# EAGLE design Tiny84_board (EAGLE 6.4)
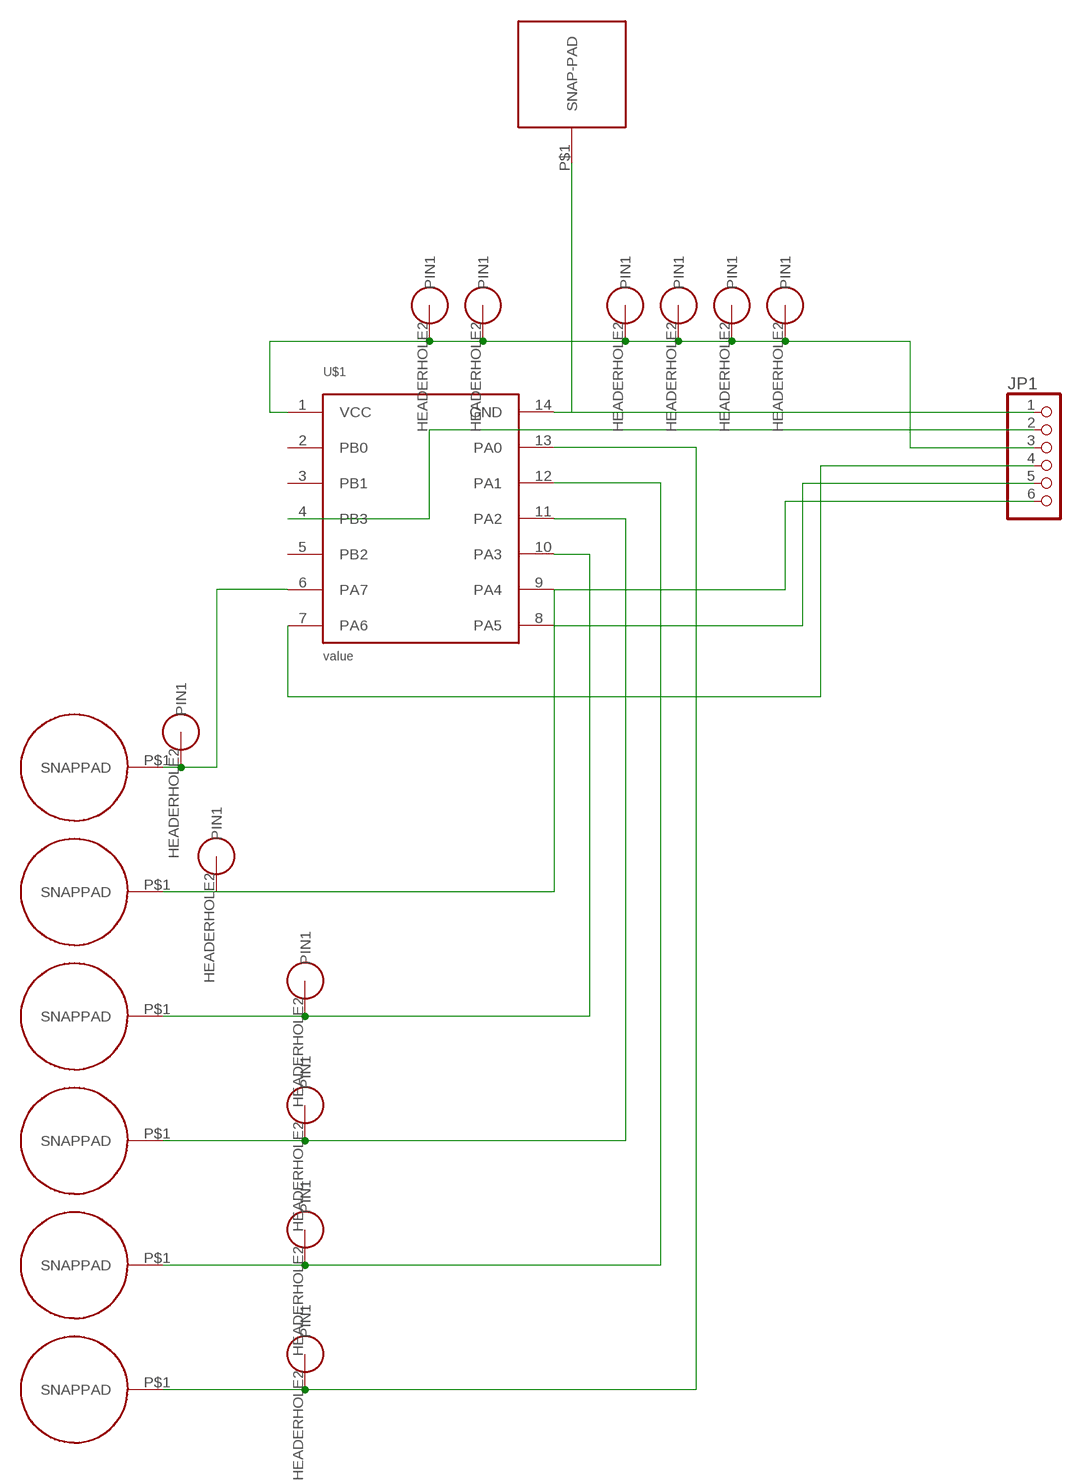
[diagram p0: schematic, sheet 1]

## Parts
JP1  PINHD-1X6/90  [1X06/90]
U$1  ATTINY84  [SOIC14]
U$2  SNAP-PAD_7MM_ROUND  [SNAP-PAD_7MM_RD]
U$3  SNAP-PAD_7MM_ROUND  [SNAP-PAD_7MM_RD]
U$4  SNAP-PAD_7MM_ROUND  [SNAP-PAD_7MM_RD]
U$5  SNAP-PAD_7MM_ROUND  [SNAP-PAD_7MM_RD]
U$6  SNAP-PAD_7MM_ROUND  [SNAP-PAD_7MM_RD]
U$7  SNAP-PAD_7MM_ROUND  [SNAP-PAD_7MM_RD]
U$14  SNAP-PAD_7MM_SQUARE  [SNAP-PAD_7MM_SQ]
U$15  HEADER_1PIN  [HEADER_1PIN]
U$16  HEADER_1PIN  [HEADER_1PIN]
U$17  HEADER_1PIN  [HEADER_1PIN]
U$19  HEADER_1PIN  [HEADER_1PIN]
U$20  HEADER_1PIN  [HEADER_1PIN]
U$21  HEADER_1PIN  [HEADER_1PIN]
U$24  HEADER_1PIN  [HEADER_1PIN]
U$25  HEADER_1PIN  [HEADER_1PIN]
U$26  HEADER_1PIN  [HEADER_1PIN]
U$27  HEADER_1PIN  [HEADER_1PIN]
U$30  HEADER_1PIN  [HEADER_1PIN]
U$31  HEADER_1PIN  [HEADER_1PIN]

## Nets
N$2: JP1.1 U$1.14(GND) U$14.P$1(SNAP-PAD)
N$3: U$1.6(PA7) U$2.P$1(SNAPPAD) U$27.HEADERHOLE2(PIN1)
N$4: JP1.4 U$1.7(PA6)
N$5: JP1.5 U$1.8(PA5)
N$6: JP1.6 U$1.9(PA4) U$3.P$1(SNAPPAD) U$26.HEADERHOLE2(PIN1)
N$8: U$1.13(PA0) U$7.P$1(SNAPPAD) U$21.HEADERHOLE2(PIN1)
N$14: JP1.2 U$1.4(PB3)
N$23: U$1.12(PA1) U$6.P$1(SNAPPAD) U$20.HEADERHOLE2(PIN1)
N$24: U$1.10(PA3) U$4.P$1(SNAPPAD) U$17.HEADERHOLE2(PIN1)
N$25: U$1.11(PA2) U$5.P$1(SNAPPAD) U$19.HEADERHOLE2(PIN1)
VCC: JP1.3 U$1.1(VCC) U$15.HEADERHOLE2(PIN1) U$16.HEADERHOLE2(PIN1) U$24.HEADERHOLE2(PIN1) U$25.HEADERHOLE2(PIN1) U$30.HEADERHOLE2(PIN1) U$31.HEADERHOLE2(PIN1)
Unconnected: U$1.2(PB0) U$1.3(PB1) U$1.5(PB2)

## Library data of the parts
JP1 = pinhead:PINHD-1X6: PIN HEADER
U$1 = hannahsEagleLib:ATTINY84
U$2-U$7 = hannahsEagleLib:SNAP-PAD_7MM_ROUND
U$14 = hannahsEagleLib:SNAP-PAD_7MM_SQUARE
U$15-U$17 U$19-U$21 U$24-U$27 U$30 U$31 = hannahsEagleLib:HEADER_1PIN

## Board
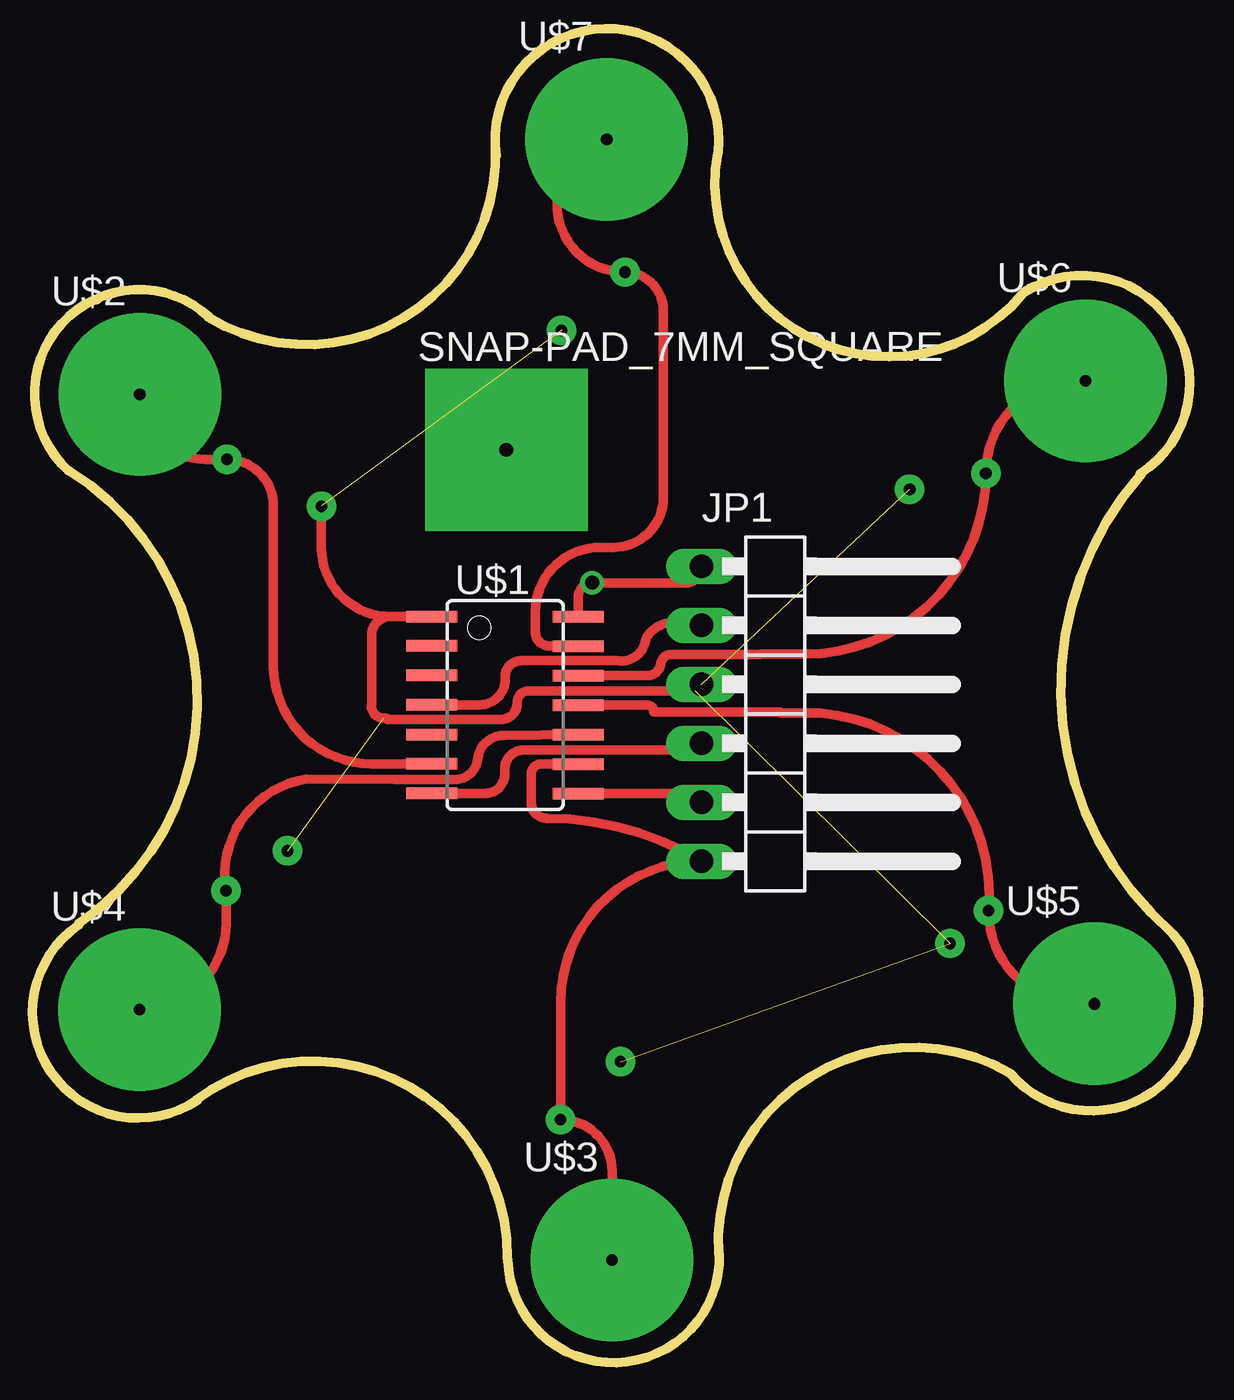
[diagram p1: board, top side]
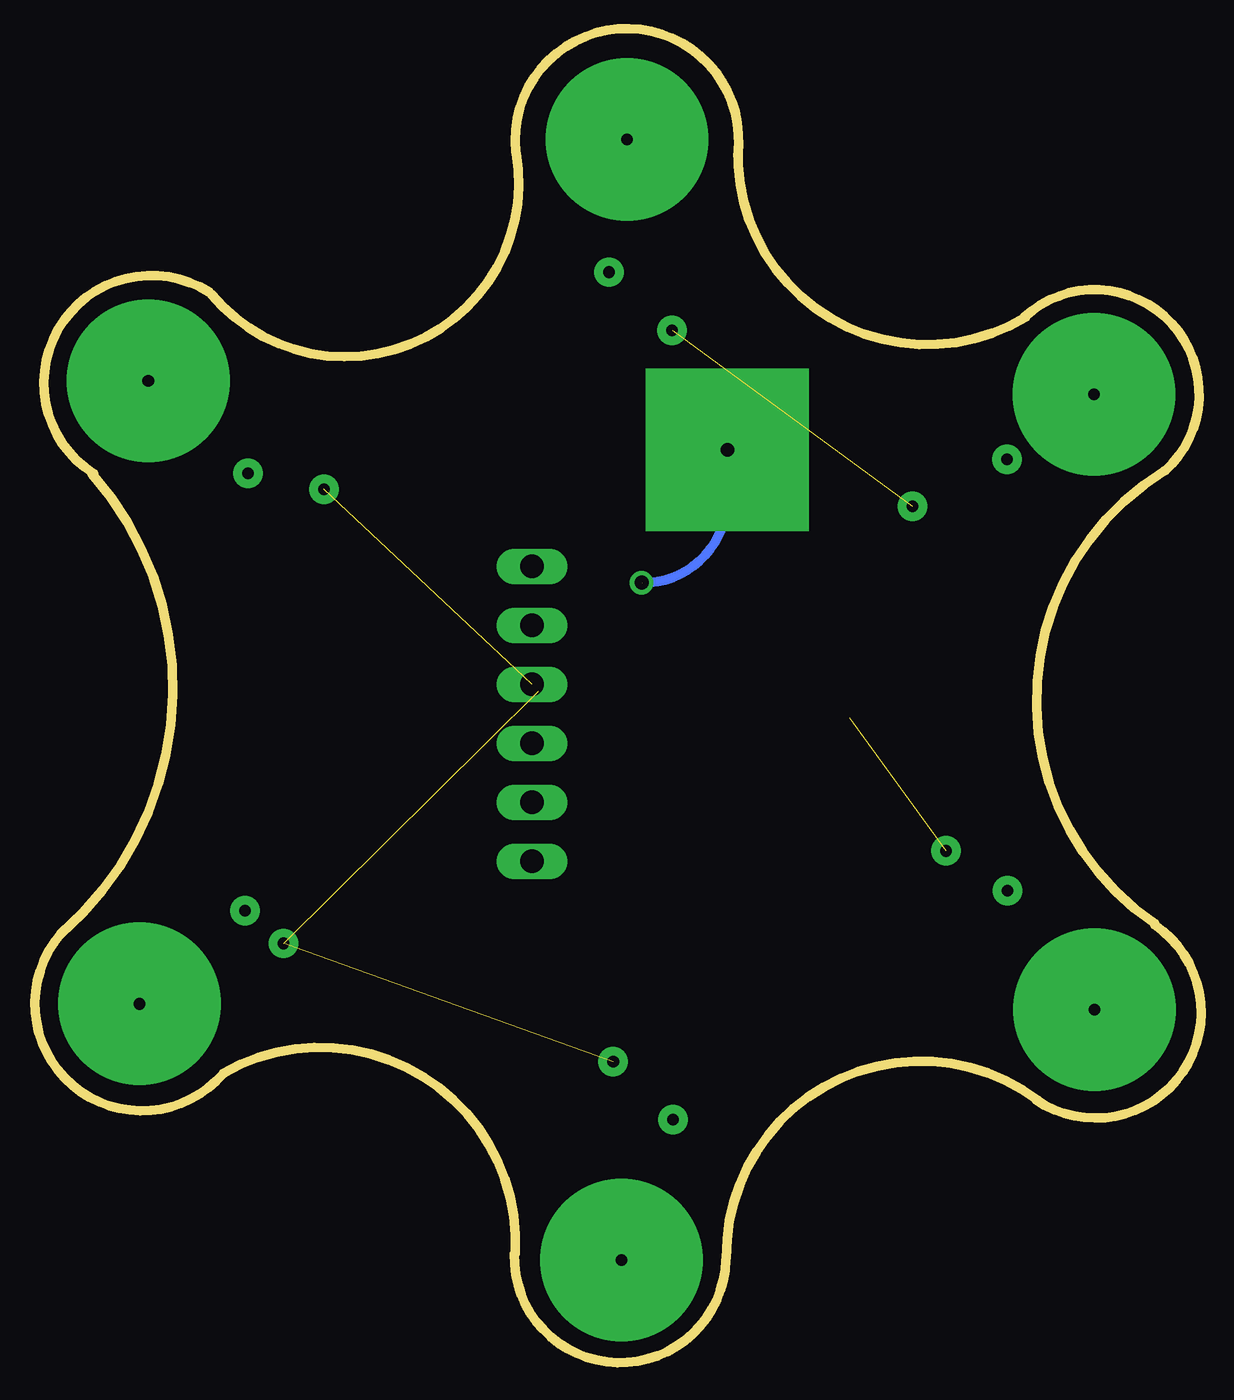
[diagram p2: board, bottom side, seen from below]

No outline drawn. Coordinates in mm, seen from the top.
Copper layers (1*16): Top 0.035mm / dielectric 1.5mm / Bottom 0.035mm
Design rules "default": minimum track width 10mil, minimum drill 24mil, track to track 8mil, track to pad 8mil, pad to pad 8mil, via to via 8mil, smd to smd 8mil, copper to edge 40mil, drill to drill 8mil, minimum pad ring 10mil, minimum via ring 8mil, stop-mask expansion 4mil, vias tented up to drill 0mil, thermal gap 10mil
Milling: 12 lines

### Footprints (pad centres in the part's own frame; a part is rotated, then mirrored left to right if it is on the bottom)
1X06/90 = drill 1.016 long: 1 -6.35,-3.81; 2 -3.81,-3.81; 3 -1.27,-3.81; 4 1.27,-3.81; 5 3.81,-3.81; 6 6.35,-3.81
SOIC14 = smd 0.5 x 2.2: 1 -1.905,-3.154; 2 -0.645,-3.154; 3 0.625,-3.154; 4 1.895,-3.154; 5 3.175,-3.154; 6 4.435,-3.154; 7 5.705,-3.154; 8 5.715,3.154; 9 4.445,3.154; 10 3.175,3.154; 11 1.905,3.154; 12 0.635,3.154; 13 -0.635,3.154; 14 -1.905,3.154
SNAP-PAD_7MM_RD = drill 0.5 pad 7: P$1 0,0
SNAP-PAD_7MM_SQ = drill 0.5 pad 7 square: P$1 0,0
HEADER_1PIN = drill 0.5 pad 1.27: HEADERHOLE2 0,0

### Placement (x,y rotation side)
JP1  67.83,40.47 270 top
U$1  55.56,42.75 270 top
U$2  39.83,54.23 0 top
U$3  60.17,16.93 0 top
U$4  39.81,27.73 0 top
U$5  80.93,27.97 0 top
U$6  80.55,54.81 0 top
U$7  59.93,65.21 0 top
U$14  55.62,51.84 0 top
U$15  47.65,49.41 0 top
U$16  46.19,34.56 0 top
U$17  43.54,32.85 0 top
U$19  76.38,31.98 0 top
U$20  76.26,50.82 0 top
U$21  60.72,59.49 0 top
U$24  60.53,25.48 0 top
U$25  74.72,30.58 0 top
U$26  57.95,22.98 0 top
U$27  43.58,51.42 0 top
U$30  72.98,50.14 0 top
U$31  57.99,56.99 0 top

### Tracks (layer width: path | path; a pad name or v marks a point on that pad's centre or on a via)
N$2  (1 unrouted)
  Top 0.4: U$1.14 58.71,45.53 arc-90 59.28,46.1 63.3,46.1 arc90 JP1.1
  Bottom 0.4: U$14.P$1 55.62,49.77 arc90 59.28,46.1
N$3
  Top 0.4: U$1.6 49.81,38.31 arc-90 45.59,42.53 45.59,49.42 arc90 U$27.HEADERHOLE2 42.64,51.42 arc-90 U$2.P$1
N$4
  Top 0.4: U$1.7 arc90 52.42,37.02 52.49,37.02 arc-90 52.52,37.04 54.72,37.04 arc90 55.55,37.87 55.55,38.07 arc-90 56.33,38.9 60.84,38.9 arc90 60.86,38.9 63.7,38.9 arc90 JP1.4
N$5
  Top 0.4: U$1.8 63.64,37.03 arc-90 JP1.5
N$6
  Top 0.4: U$1.9 57.11,38.3 arc90 56.69,37.87 56.69,36.62 arc90 57.35,35.97 arc-31 JP1.6 arc90 57.95,28.05 U$26.HEADERHOLE2 arc-90 60.17,20.76 U$3.P$1
N$8
  Top 0.4: U$1.13 57.47,43.38 arc-90 56.86,43.99 56.86,44.84 arc-90 59.65,47.63 60.21,47.63 arc90 62.38,49.8 62.38,57.83 arc90 U$21.HEADERHOLE2 arc-164 U$7.P$1
N$14
  Top 0.4: U$1.4 54.46,40.85 arc90 55.57,41.95 55.57,42.08 arc-90 56.23,42.75 60.38,42.75 arc90 61.62,43.66 arc-90 63.2,44.28 JP1.2
N$23
  Top 0.4: U$1.12 61.7,42.11 arc81 62.26,42.59 arc-90 62.75,43.03 66.53,43.03 66.55,43.04 68.47,43.04 arc90 U$20.HEADERHOLE2 arc-94 U$6.P$1
N$24
  Top 0.4: U$1.10 55.49,39.54 arc84 54.38,38.52 arc-95 53.21,37.65 50.96,37.65 50.82,37.64 47,37.66 arc90 U$17.HEADERHOLE2 43.54,31.46 arc-90 U$4.P$1
N$25
  Top 0.4: U$1.11 60.83,40.84 arc90 60.83,40.84 61.68,40.84 arc-90 61.97,40.55 67.35,40.55 arc-90 67.41,40.49 69.14,40.49 arc-90 U$19.HEADERHOLE2 arc97 U$5.P$1
N$31  (via drill 0.6 pad 0.4)
  other vias: 55.61,51.84
N$32  (via drill 0.6 pad 0.4)
  other vias: 59.3,46.12
VCC  (5 unrouted)
  Top 0.4: U$1.1 arc90 U$1.1 50.62,44.66 | 50.62,44.66 arc90 49.81,43.85 49.81,40.83 arc-90 49.79,40.82 arc90 50.33,40.28 50.45,40.28 arc90 50.5,40.23 55.4,40.23 arc90 56.08,40.9 56.08,40.95 arc-90 56.58,41.46 63.74,41.46 arc90 JP1.3 | 50.62,44.66 arc-90 47.65,47.63 U$15.HEADERHOLE2